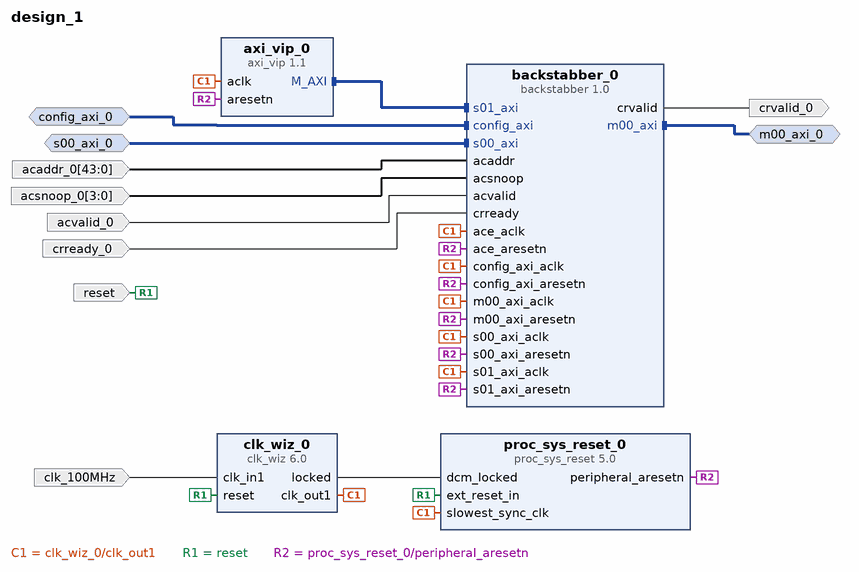
[diagram p0: block diagram of the top level]
# Vivado block design design_1, xczu9eg-ffvb1156-2-e, Vivado 2022.1
create_bd_design design_1

create_bd_intf_port -mode Slave -vlnv xilinx.com:interface:aximm_rtl:1.0 s00_axi_0
set_property -dict [list \
  CONFIG.ADDR_WIDTH 40 \
  CONFIG.ARUSER_WIDTH 1 \
  CONFIG.AWUSER_WIDTH 1 \
  CONFIG.BUSER_WIDTH 1 \
  CONFIG.DATA_WIDTH 128 \
  CONFIG.HAS_BRESP 1 \
  CONFIG.HAS_BURST 1 \
  CONFIG.HAS_CACHE 1 \
  CONFIG.HAS_LOCK 1 \
  CONFIG.HAS_PROT 1 \
  CONFIG.HAS_QOS 1 \
  CONFIG.HAS_REGION 0 \
  CONFIG.HAS_RRESP 1 \
  CONFIG.HAS_WSTRB 1 \
  CONFIG.ID_WIDTH 16 \
  CONFIG.MAX_BURST_LENGTH 256 \
  CONFIG.NUM_READ_OUTSTANDING 2 \
  CONFIG.NUM_READ_THREADS 1 \
  CONFIG.NUM_WRITE_OUTSTANDING 2 \
  CONFIG.NUM_WRITE_THREADS 1 \
  CONFIG.PROTOCOL AXI4 \
  CONFIG.READ_WRITE_MODE READ_WRITE \
  CONFIG.RUSER_BITS_PER_BYTE 0 \
  CONFIG.RUSER_WIDTH 1 \
  CONFIG.SUPPORTS_NARROW_BURST 1 \
  CONFIG.WUSER_BITS_PER_BYTE 0 \
  CONFIG.WUSER_WIDTH 1 \
] [get_bd_intf_ports s00_axi_0]
create_bd_intf_port -mode Slave -vlnv xilinx.com:interface:aximm_rtl:1.0 config_axi_0
set_property -dict [list \
  CONFIG.ADDR_WIDTH 40 \
  CONFIG.ARUSER_WIDTH 1 \
  CONFIG.AWUSER_WIDTH 1 \
  CONFIG.BUSER_WIDTH 0 \
  CONFIG.DATA_WIDTH 128 \
  CONFIG.HAS_BRESP 1 \
  CONFIG.HAS_BURST 1 \
  CONFIG.HAS_CACHE 1 \
  CONFIG.HAS_LOCK 1 \
  CONFIG.HAS_PROT 1 \
  CONFIG.HAS_QOS 1 \
  CONFIG.HAS_REGION 1 \
  CONFIG.HAS_RRESP 1 \
  CONFIG.HAS_WSTRB 1 \
  CONFIG.ID_WIDTH 16 \
  CONFIG.MAX_BURST_LENGTH 256 \
  CONFIG.NUM_READ_OUTSTANDING 2 \
  CONFIG.NUM_READ_THREADS 1 \
  CONFIG.NUM_WRITE_OUTSTANDING 2 \
  CONFIG.NUM_WRITE_THREADS 1 \
  CONFIG.PROTOCOL AXI4 \
  CONFIG.READ_WRITE_MODE READ_WRITE \
  CONFIG.RUSER_BITS_PER_BYTE 0 \
  CONFIG.RUSER_WIDTH 0 \
  CONFIG.SUPPORTS_NARROW_BURST 1 \
  CONFIG.WUSER_BITS_PER_BYTE 0 \
  CONFIG.WUSER_WIDTH 0 \
] [get_bd_intf_ports config_axi_0]
create_bd_intf_port -mode Master -vlnv xilinx.com:interface:aximm_rtl:1.0 m00_axi_0
set_property -dict [list \
  CONFIG.ADDR_WIDTH 40 \
  CONFIG.DATA_WIDTH 128 \
  CONFIG.HAS_REGION 0 \
  CONFIG.NUM_READ_OUTSTANDING 2 \
  CONFIG.NUM_WRITE_OUTSTANDING 2 \
  CONFIG.PROTOCOL AXI4 \
] [get_bd_intf_ports m00_axi_0]
create_bd_port -dir I -type clk clk_100MHz
set_property -dict {CONFIG.FREQ_HZ 100000000} [get_bd_ports clk_100MHz]
create_bd_port -dir I -type rst reset
set_property -dict {CONFIG.POLARITY ACTIVE_HIGH} [get_bd_ports reset]
create_bd_port -dir I -from 3 -to 0 acsnoop_0
create_bd_port -dir I acvalid_0
create_bd_port -dir I -from 43 -to 0 acaddr_0
create_bd_port -dir O crvalid_0
create_bd_port -dir I crready_0

create_bd_cell -type ip -vlnv xilinx.com:ip:axi_vip:1.1 axi_vip_0
set_property -dict [list \
  CONFIG.ADDR_WIDTH 32 \
  CONFIG.DATA_WIDTH 32 \
  CONFIG.HAS_BRESP 1 \
  CONFIG.HAS_PROT 1 \
  CONFIG.HAS_RRESP 1 \
  CONFIG.HAS_WSTRB 1 \
  CONFIG.INTERFACE_MODE MASTER \
  CONFIG.PROTOCOL AXI4LITE \
  CONFIG.READ_WRITE_MODE READ_WRITE \
] [get_bd_cells axi_vip_0]
create_bd_cell -type ip -vlnv xilinx.com:ip:clk_wiz:6.0 clk_wiz_0
create_bd_cell -type ip -vlnv xilinx.com:ip:proc_sys_reset:5.0 proc_sys_reset_0
create_bd_cell -type ip -vlnv user.org:user:backstabber:1.0 backstabber_0

# ---- connections ----

connect_bd_intf_net [get_bd_intf_pins axi_vip_0/M_AXI] [get_bd_intf_pins backstabber_0/s01_axi]
connect_bd_intf_net [get_bd_intf_ports m00_axi_0] [get_bd_intf_pins backstabber_0/m00_axi]
connect_bd_intf_net -intf_net config_axi_0_1 [get_bd_intf_ports config_axi_0] [get_bd_intf_pins backstabber_0/config_axi]
connect_bd_intf_net -intf_net s00_axi_0_1 [get_bd_intf_ports s00_axi_0] [get_bd_intf_pins backstabber_0/s00_axi]
connect_bd_net -net acaddr_0_1 [get_bd_ports acaddr_0] [get_bd_pins backstabber_0/acaddr]
connect_bd_net -net acsnoop_0_1 [get_bd_ports acsnoop_0] [get_bd_pins backstabber_0/acsnoop]
connect_bd_net -net acvalid_0_1 [get_bd_ports acvalid_0] [get_bd_pins backstabber_0/acvalid]
connect_bd_net [get_bd_pins backstabber_0/crvalid] [get_bd_ports crvalid_0]
connect_bd_net [get_bd_ports clk_100MHz] [get_bd_pins clk_wiz_0/clk_in1]
connect_bd_net [get_bd_pins clk_wiz_0/locked] [get_bd_pins proc_sys_reset_0/dcm_locked]
connect_bd_net -net clk_wiz_clk_out1 [get_bd_pins clk_wiz_0/clk_out1] \
  [get_bd_pins axi_vip_0/aclk] [get_bd_pins proc_sys_reset_0/slowest_sync_clk] [get_bd_pins backstabber_0/config_axi_aclk] \
  [get_bd_pins backstabber_0/ace_aclk] [get_bd_pins backstabber_0/m00_axi_aclk] [get_bd_pins backstabber_0/s00_axi_aclk] \
  [get_bd_pins backstabber_0/s01_axi_aclk]
connect_bd_net -net crready_0_1 [get_bd_ports crready_0] [get_bd_pins backstabber_0/crready]
connect_bd_net [get_bd_ports reset] [get_bd_pins clk_wiz_0/reset] [get_bd_pins proc_sys_reset_0/ext_reset_in]
connect_bd_net -net rst_clk_wiz_100M_peripheral_aresetn [get_bd_pins proc_sys_reset_0/peripheral_aresetn] \
  [get_bd_pins axi_vip_0/aresetn] [get_bd_pins backstabber_0/config_axi_aresetn] [get_bd_pins backstabber_0/ace_aresetn] \
  [get_bd_pins backstabber_0/m00_axi_aresetn] [get_bd_pins backstabber_0/s00_axi_aresetn] \
  [get_bd_pins backstabber_0/s01_axi_aresetn]

# ---- address map ----
assign_bd_address -offset 0x80010000 -range 64K -target_address_space [get_bd_addr_spaces axi_vip_0/Master_AXI] [get_bd_addr_segs backstabber_0/s01_axi/reg0]

validate_bd_design
save_bd_design
